# Altium project PCB_DO_AN_MACH_DIEN_TU.PrjPcb
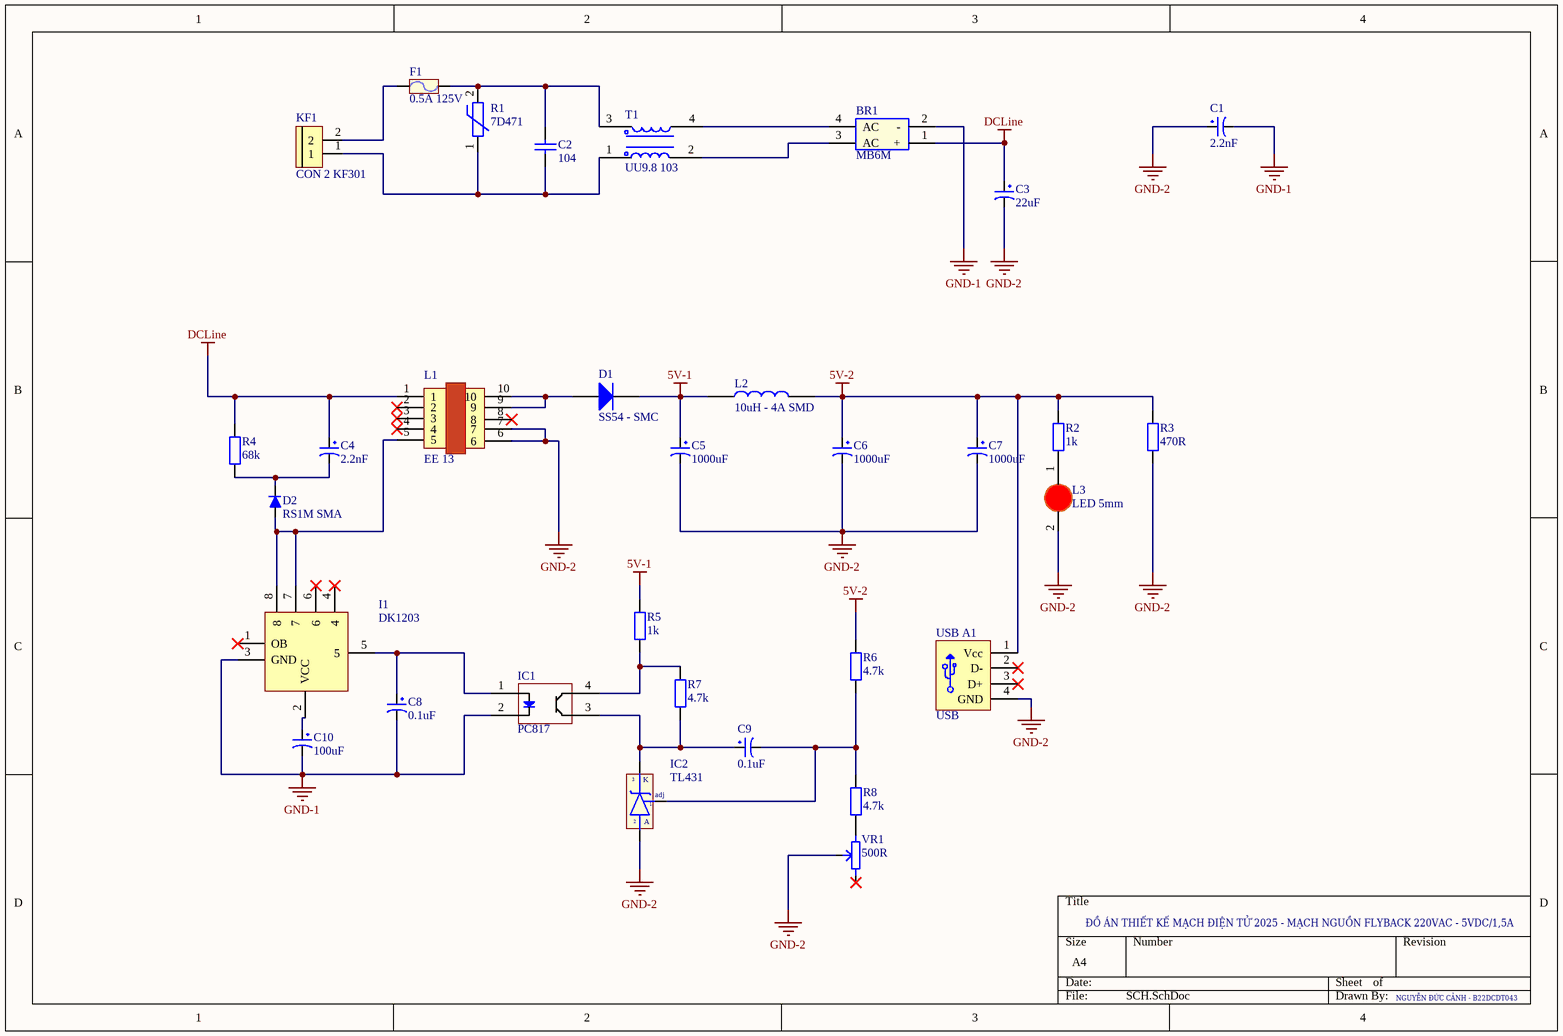
[diagram p0: SCH.SchDoc]
1 sheet, 32 parts. Net scope: global (net labels, ports and power ports of the same name join across sheets).
Board files: Ver1.PcbDoc, Ver2.PcbDoc

## Sheet SCH.SchDoc
size A4

### Parts
BR1  MB6M  [MB6M]
C1  2.2nF  [tu hoa 8mm]
C2  104  [tu gom]
C3  22uF  [tu hoa 13mm]
C4  2.2nF  [tu hoa 8mm]
C5  1000uF  [tu hoa 10mm]
C6  1000uF  [tu hoa 10mm]
C7  1000uF  [tu hoa 10mm]
C8  0.1uF  [tu hoa 5mm]
C9  0.1uF  [tu hoa 5mm]
C10  100uF  [tu hoa 5mm]
D1  SS54 - SMC  [DIODE SMA]
D2  RS1M SMA  [RS1M SMA]
F1  0.5A 125V  [Cau Chi SMD1808]
I1  DK1203  [DK1203]
IC1  PC817  [PC817]
IC2  TL431  [qto-92]
KF1  CON 2 KF301  [Con 2 KF301 5.08]
L1  EE 13  [Trans EE13]
L2  10uH - 4A SMD  [Cuon Cam 7x7x5]
L3  LED 5mm  [LED-5MM-RED]
R1  7D471  [Inrush current limiter]
R2  1k  [tro vach 1/4w]
R3  470R  [tro vach 1/2w]
R4  68k  [tro vach 1/4w]
R5  1k  [tro vach 1/4w]
R6  4.7k  [tro vach 1/4w]
R7  4.7k  [tro vach 1/4w]
R8  4.7k  [tro vach 1/4w]
T1  UU9.8 103  [UU8.9 103]
USB_A1  USB  [USB A]
VR1  500R  [Bien Tro Tam Giac Dung]

### Nets
5V-1: C5.1 D1.2(K) L2.1 R5.2
5V-2: C6.1 C7.1 L2.2 R2.2 R3.2 R6.2 USB_A1.1(Vcc)
DCLine: BR1.1(+) C3.1 C4.1 L1.1 R4.2
GND-1: BR1.2(-) C1.2 C8.2 C10.2 I1.3(GND) IC1.2
GND-2: C1.1 C3.2 C5.2 C6.2 C7.2 IC2.2(A) L1.6 L1.7 L3.2(K) R3.1 USB_A1.4(GND) VR1.2
NetBR1_3: BR1.3(AC) T1.2
NetBR1_4: BR1.4(AC) T1.4
NetC2_1: C2.1 F1.2 R1.2 T1.3
NetC2_2: C2.2 KF1.1 R1.1 T1.1
NetC4_2: C4.2 D2.1 R4.1
NetC8_1: C8.1 I1.5 IC1.1
NetC9_1: C9.1 IC1.3 IC2.3(K) R7.1
NetC9_2: C9.2 IC2.1(adj) R6.1 R8.2
NetC10_1: C10.1 I1.2(VCC)
NetD1_1: D1.1(A) L1.9 L1.10
NetD2_2: D2.2 I1.7 I1.8 L1.5
NetF1_1: F1.1 KF1.2
NetIC1_4: IC1.4 R5.1 R7.2
NetL3_1: L3.1(A) R2.1
NetR8_1: R8.1 VR1.3

Not connected (* = marked no-connect by the designer): I1 1(OB)* 4* 6*; L1 2* 3* 4* 8*; USB_A1 2(D-)* 3(D+)*; VR1 1*

### Notes on the sheet
- ĐỒ ÁN THIẾT KẾ MẠCH ĐIỆN TỬ 2025 - MẠCH NGUỒN FLYBACK 220VAC - 5VDC/1,5A
- NGUYỄN ĐỨC CẢNH - B22DCDT043

### Library data of the parts
C1 C4 = Tu Hoa 2.2uF 400V 8x12: Cắm; Don_Vi: Con; So_Chan: 2; Ten_Linh_Kien: Tụ Hóa 2.2uF 400V 8x12MM; Ma_Hang: MH003743; Chung_Loai: Cắm; Kieu_Chan: *
C2 = Tu gom 104 50V: Cắm; So_Chan: 2; Ten_Linh_Kien: Tụ gốm 104 100nF 50V; Don_Vi: Con; Ma_Hang: MH004761; Chung_Loai: Cắm; Kieu_Chan: *
C3 = Tu Hoa 22uF 400V 13x20: Cắm; Don_Vi: Con; So_Chan: 2; Ten_Linh_Kien: Tụ Hóa 22uF 400V 13x20MM; Ma_Hang: MH004801; Chung_Loai: Cắm; Kieu_Chan: *
C5-C7 = Tu Hoa 1000uF 10V 10x12: Cắm; So_Chan: 2; Don_Vi: Con; Ten_Linh_Kien: Tụ Hóa 1000uF 10V 10x12MM; Ma_Hang: MH006614; Kieu_Chan: *; Chung_Loai: Cắm
C8 C9 = Tu Hoa 0.1uF 50V 5x11: Cắm; Don_Vi: Con; So_Chan: 2; Ten_Linh_Kien: Tụ Hóa 0.1uF 50V; Ma_Hang: MH006853; Chung_Loai: Cắm; Kieu_Chan: *
C10 = Tu Hoa 100uF 16V 5x7: Cắm; Don_Vi: Con; So_Chan: 2; Ten_Linh_Kien: Tụ Hóa 100uF 16V 5x7MM; Ma_Hang: MH001347; Chung_Loai: Cắm; Kieu_Chan: *
D1 = Diode SS34 ( 1N5822 ): Dán; Don_Vi: Con; Ma_Hang: MH002104; Ten_Linh_Kien: Diode SS34 3A 40V SMA ( 1N5822 SS34A); Kieu_Chan: *; Chung_Loai: Dán
F1 = Cau chi 0.5A 125V SMD1808: Ma_Hang: MH009241; Ten: Cầu Chì 0.5A 125V SMD1808 0451.500MRL
IC1 = PC871
IC2 = TL431: Programmable Shunt Regulator; Value: TL431
KF1 = CON 2 KF301: Cắm; Ma_Hang: MH000987; Ten_Linh_Kien: CON 2 KF301-2P 5.08MM Xanh Dương; Chung_Loai: Cắm; Ghi_Chu: *; Kieu_Chan: *; Don_Vi: Con
L1 = EE 20-10-6
L2 = CUON CAM 47uH SMD: Dán; Don_Vi: Con; Ma_Hang: MH004211; Ten_Linh_Kien: Cuộn Cảm 47uH 7x7x4MM CD74R; Ghi_Chu: *; Kieu_Chan: *; Chung_Loai: Dán
L3 = LED 5mm Do: Cắm; Don_Vi: Con; Ma_Hang: MH008967; Ten_Linh_Kien: Led 5MM Phủ Đỏ (1000c); Ghi_Chu: *; Kieu_Chan: *; Chung_Loai: Cắm
R1 = Tu chong set
R2 R5 = Tro Vach 1/4W 5% 1k: Cắm; Don_Vi: Con; So_Chan: 2; Ten_Linh_Kien: Trở Vạch 1/4w 5% 1k; Ma_Hang: MH007390; Chung_Loai: Cắm; Kieu_Chan: *
R3 = Tro Vach 1/2W 5% 470R: Cắm; Don_Vi: Con; So_Chan: 2; Ten_Linh_Kien: Trở 5% 1/2w 470R; Ma_Hang: MH006200; Chung_Loai: Cắm; Kieu_Chan: *
R4 = Tro Vach 1/4W 5% 68k: Cắm; Don_Vi: Con; So_Chan: 2; Ten_Linh_Kien: Trở Vạch 1/4w 5% 68k; Ma_Hang: MH007332; Kieu_Chan: *; Chung_Loai: Cắm
R6-R8 = Tro Vach 1/4W 5% 4.7k: Cắm; Don_Vi: Con; So_Chan: 2; Ten_Linh_Kien: Trở Vạch 1/4w 5% 4.7k; Ma_Hang: MH007317; Chung_Loai: Cắm; Kieu_Chan: *
USB_A1 = USB TYPE A FEMALE
VR1 = Bien tro tam giac 1K Dung: Cắm; Ten_Linh_Kien: Biến Trở Tam Giác 102-1K RM065; Don_Vi: Con; Ma_Hang: MH003709; Ghi_Chu: *; Kieu_Chan: *; Chung_Loai: Cắm